# Altium schematic sheet reference_2v5_LTC6655.SchDoc
size A4
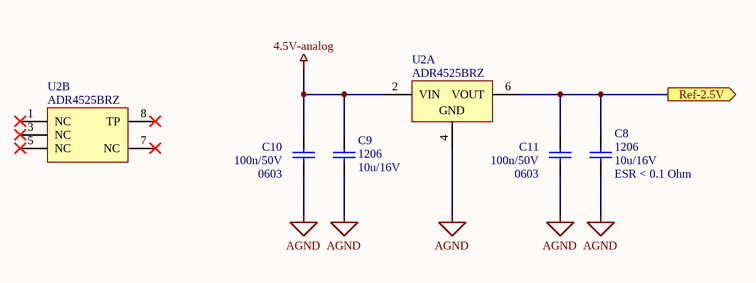
[diagram p0: reference_2v5_LTC6655.SchDoc]

## Parts
C8  Packge: 1206  [SMD_Capacitor_1206]  (hidden comment: 10u/16V)
C9  Packge: 1206  [SMD_Capacitor_1206]  (hidden comment: 10u/16V)
C10  Package: 0603  [SMD_Capacitor_0603]  (hidden comment: 100n/50V)
C11  Package: 0603  [SMD_Capacitor_0603]  (hidden comment: 100n/50V)
U2  ADR4525BRZ  [ADI-R-8_N]  (parts A,B of 2)

## Ports
Ref-2.5V (out)

## Nets
4.5V-analog: C9.1 C10.1 U2.2(VIN)
AGND: C8.2 C9.2 C10.2 C11.2 U2.4(GND)
Ref-2.5V: C8.1 C11.1 U2.6(VOUT) ; port Ref-2.5V

Not connected (* = marked no-connect by the designer): U2 1(NC)* 3(NC)* 5(NC)* 7(NC)* 8(TP)*

## Notes on the sheet
- (near C8) ESR < 0.1 Ohm
- Title:
- Sheet:
- of
- Author:
- Model:
- Document Number:
- Checked by:
- Iss-Rev:
- Approved by:
- Date:
- File name:

## Library data of the parts
C8 C9 = Cer_C1206T106K4RACTU: Ceramic Cap Kemet COTS 10u/16V X7R 1206; ManufacturerPartNumber: C1206T106K4RACTU; Manufacturer: Kemet; Value: 10u/16V
C10 C11 = Cer_C0603T104K5RALTU: Ceramic Cap Kemet COTS 100n/50V X7R 0603; Manufacturer: Kemet; ManufacturerPartNumber: C0603T104K5RALTU; Value: 100n/50V
U2 = ADR4525BRZ: Ultralow Noise, High Accuracy Voltage Reference, 2.5 V Output, 3 to 15 V Supply, Industrial, 8-pin SOIC (R-8), Tube; Manufacturer: Analog Devices; Max V Supply (V): 15; Min V Supply (V): 3; Ref Out TC (ppm/C): 2; Vout: 2.5V; DatasheetVersion: Rev. 0; PackageVersion: 060506-A, 06/2006; PackageReference: R-8; PackageDescription: 8-Pin Standard Small Outline Package, Body 4.9 x 3.9 mm, Pitch 1.27 mm; Supplier 1: Digi-Key; Supplier Part Number 1: ADR4525BRZ-ND; Supplier 2: Farnell; Supplier Part Number 2: 2112686; Supplier 3: Farnell; Supplier Part Number 3: 2148887; Supplier 4: Mouser; Supplier Part Number 4: 584-ADR4525BRZ; Packing: Tube; Operating Temp Range: -40 to 125 degC; Mounting Technology: Surface Mount; Code_JEDEC: MS-012-AA; PartNumber: ADR4525BRZ; ComponentLink1Description: Manufacturer URL; ComponentLink1URL: http://www.analog.com/en/index.html; ComponentLink2Description: Datasheet; ComponentLink2URL: http://www.analog.com/static/imported-files/data_sheets/ADR4520_4525_4530_4533_4540_4550.pdf; ComponentLink3Description: Package Specification; ComponentLink3URL: http://www.analog.com/static/imported-files/packages/PKG_PDF/SOIC_Narrow%20(R)/R_8.pdf; ComponentLink4Description: URL Link1; ComponentLink4URL: Product URL:http://www.analog.com/en/special-linear-functions/voltage-references/adr4525/products/product.html